# Altium schematic sheet kuzgunv2.0.SchDoc
size A4
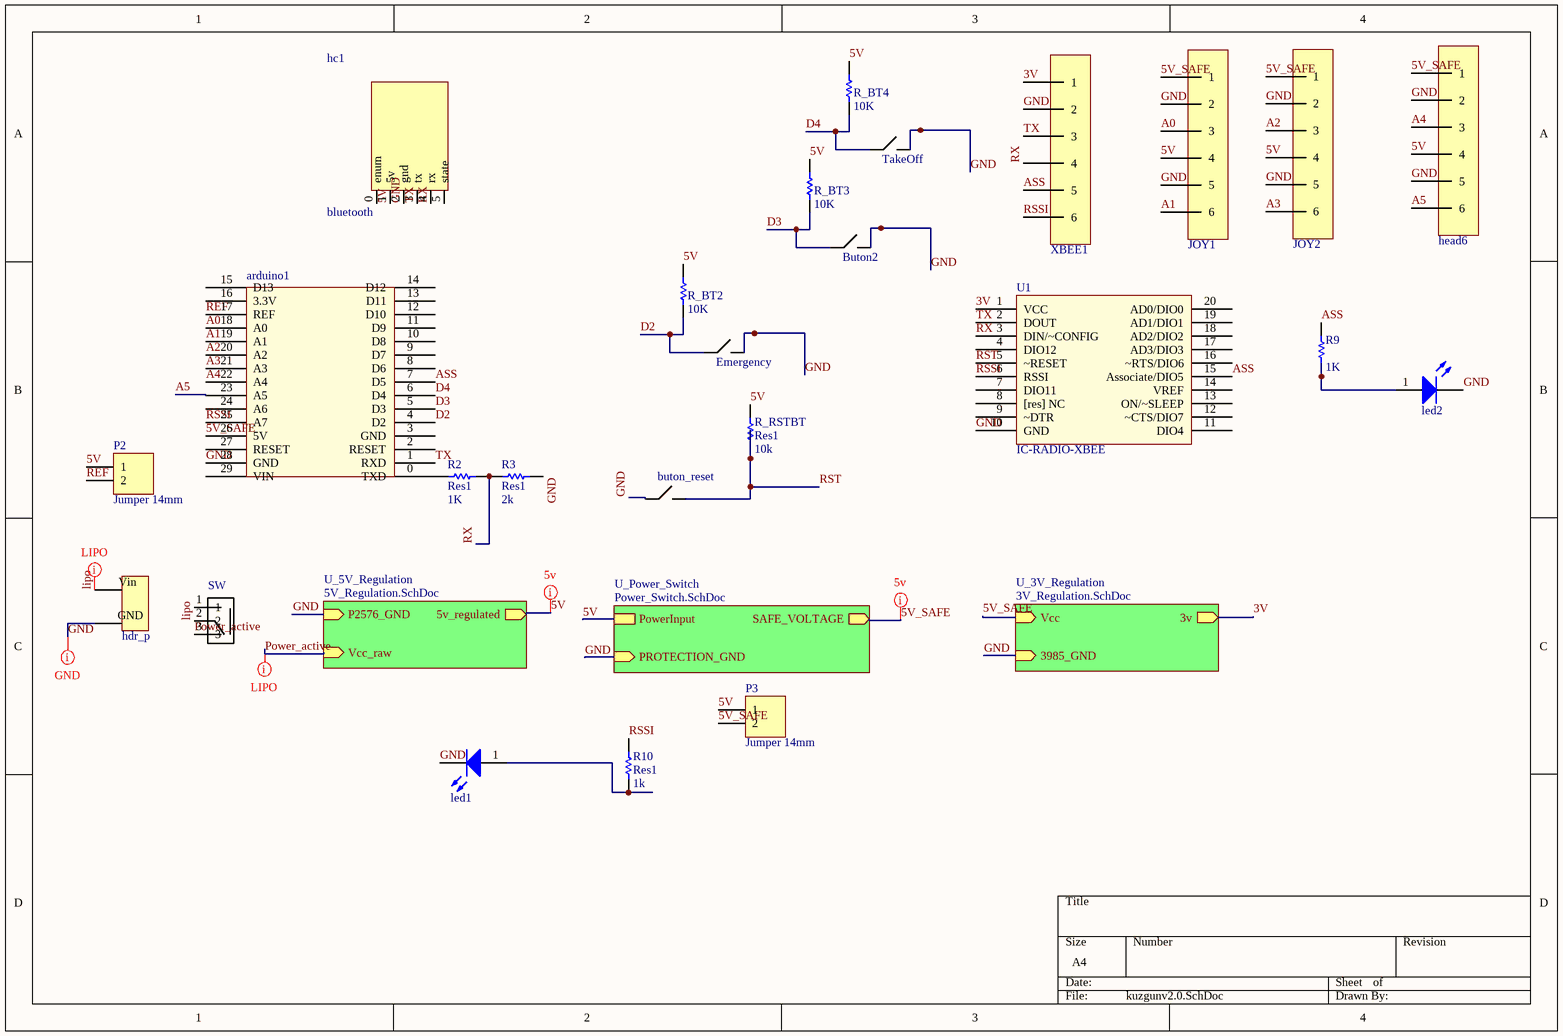
[diagram p0: kuzgunv2.0.SchDoc]

## Parts
arduino1  arduinoNano  [Arduino nano]  (value not drawn)
Buton2  buton  [4pin_smd]  (value not drawn)
buton_reset  buton  [4pin_smd]  (value not drawn)
Emergency  buton  [4pin_smd]  (value not drawn)
hc1  bluetooth  [hc05]
hdr_p  header_2_power  [HDR2_POWER]  (value not drawn)
head6  header_6  [hdr_6pin]  (value not drawn)
JOY1  header_6  [hdr_6pin]  (value not drawn)
JOY2  header_6  [hdr_6pin]  (value not drawn)
led1  L_green  [Led_green]  (value not drawn)
led2  L_green  [Led_green]  (value not drawn)
P2  Jumper 14mm  [jumper2pin_1.27]
P3  Jumper 14mm  [jumper2pin_1.27]
R1  R_BT4  value 10K  [led]
R2  Res1  value 1K  [led]
R3  Res1  value 2k  [led]
R4  R_BT3  value 10K  [led]
R5  R_BT2  value 10K  [led]
R9  value 1K  [led]  (hidden comment: Res1)
R10  Res1  value 1k  [led]
R_RSTBT  Res1  value 10k  [led]
SW  Master_S  [SW]  (value not drawn)
TakeOff  buton  [4pin_smd]  (value not drawn)
U1  IC-RADIO-XBEE  [XBee Standard]
XBEE1  header_6  [hdr6_1.27]  (value not drawn)

## Sub-sheets
U_3V_Regulation = 3V_Regulation.SchDoc: Vcc (in), 3v (out), 3985_GND (in)
U_5V_Regulation = 5V_Regulation.SchDoc: 5v_regulated (out), P2576_GND (in), Vcc_raw (in)
U_Power_Switch = Power_Switch.SchDoc: PowerInput, SAFE_VOLTAGE (out), PROTECTION_GND (in)

## Nets
3V: U1.1(VCC) XBEE1.1 ; sheet U_3V_Regulation/3v
5V: hc1.1(5v) head6.4 JOY1.4 JOY2.4 P2.1 P3.1 R1.2 R4.2 R5.2 R_RSTBT.2 ; sheet U_Power_Switch/PowerInput, sheet U_5V_Regulation/5v_regulated
5V_SAFE: arduino1.26(5V) head6.1 JOY1.1 JOY2.1 P3.2 ; sheet U_3V_Regulation/Vcc, sheet U_Power_Switch/SAFE_VOLTAGE
A0: arduino1.18(A0) JOY1.3
A1: arduino1.19(A1) JOY1.6
A2: arduino1.20(A2) JOY2.3
A3: arduino1.21(A3) JOY2.6
A4: arduino1.22(A4) head6.3
A5: arduino1.23(A5) head6.6
ASS: arduino1.7(D5) R9.2 U1.15(Associate/DIO5) XBEE1.5
D2: arduino1.4(D2) Emergency.1 R5.1
D3: arduino1.5(D3) Buton2.1 R4.1
D4: arduino1.6(D4) R1.1 TakeOff.1
GND: arduino1.28(GND) Buton2.2 buton_reset.1 Emergency.2 hc1.2(gnd) hdr_p.GND head6.2 head6.5 JOY1.2 JOY1.5 JOY2.2 JOY2.5 led1.2(K) led2.2(K) R3.1 TakeOff.2 U1.10(GND) XBEE1.2 ; sheet U_3V_Regulation/3985_GND, sheet U_Power_Switch/PROTECTION_GND, sheet U_5V_Regulation/P2576_GND
lipo: hdr_p.Vin SW.2
Power_active: SW.3 ; sheet U_5V_Regulation/Vcc_raw
REF: arduino1.17(REF) P2.2
RSSI: arduino1.25(A7) R10.2 U1.6(RSSI) XBEE1.6
RST: buton_reset.2 R_RSTBT.1 U1.5(~RESET)
RX: hc1.4(rx) R2.2 R3.2 U1.3(DIN/~CONFIG) XBEE1.4
TX: arduino1.1(RXD) hc1.3(tx) U1.2(DOUT) XBEE1.3
Netarduino1_0: arduino1.0(TXD) R2.1
Netled1_1: led1.1(V) R10.1
Netled2_1: led2.1(V) R9.1

Not connected (* = marked no-connect by the designer): arduino1 2(RESET) 3(GND) 8(D6) 9(D7) 10(D8) 11(D9) 12(D10) 13(D11) 14(D12) 15(D13) 16(3.3V) 24(A6) 27(RESET) 29(VIN); hc1 0(enum) 5(state); SW 1; U1 4(DIO12) 7(DIO11) 8([res]_NC) 9(~DTR) 11(DIO4) 12(~CTS/DIO7) 13(ON/~SLEEP) 14(VREF) 16(~RTS/DIO6) 17(AD3/DIO3) 18(AD2/DIO2) 19(AD1/DIO1) 20(AD0/DIO0)

## Layout directives
net class 5V; rule Width Constraint [Pref Width = 30mil    Min Width = 30mil    Max Width = 30mil]: lipo, Power_active
net class Undefined: GND
net class 5V; rule Width Constraint [Pref Width = 25mil    Min Width = 25mil    Max Width = 30mil]: 5V, 5V_SAFE

## Library data of the parts
hc1 = hc05: bluetooth device hc 05
R1-R5 R9 R10 R_RSTBT = Res1: Resistor; Published: 8-Jun-2000; LatestRevisionDate: 17-Jul-2002; LatestRevisionNote: Re-released for DXP Platform.; PackageReference: AXIAL-0.3; Publisher: Altium Limited; PackageDescription: Axial Device, Thru-Hole; 2 Leads; 0.3 in Pin Spacing
SW = Master_S: Switch Slide ON ON SPDT Top Slide 0.1A 12VDC 10000Cycles PC Pins Thru-Hole Bulk; MF: C&K Components; Package: DO-201 C&amp;K Components; Price: 0.29 USD; SnapEDA_Link: https://www.snapeda.com/parts/OS102011MS2QN1/C%26K%20Components/view-part/?ref=snap; Availability: Good; Value: *
U1 = IC-RADIO-XBEE: CONN XBEE TH
P2 P3 = Jumper 14mm: LatestRevisionDate: 17-Jul-2002; LatestRevisionNote: Re-released for DXP Platform.; Publisher: Altium Limited